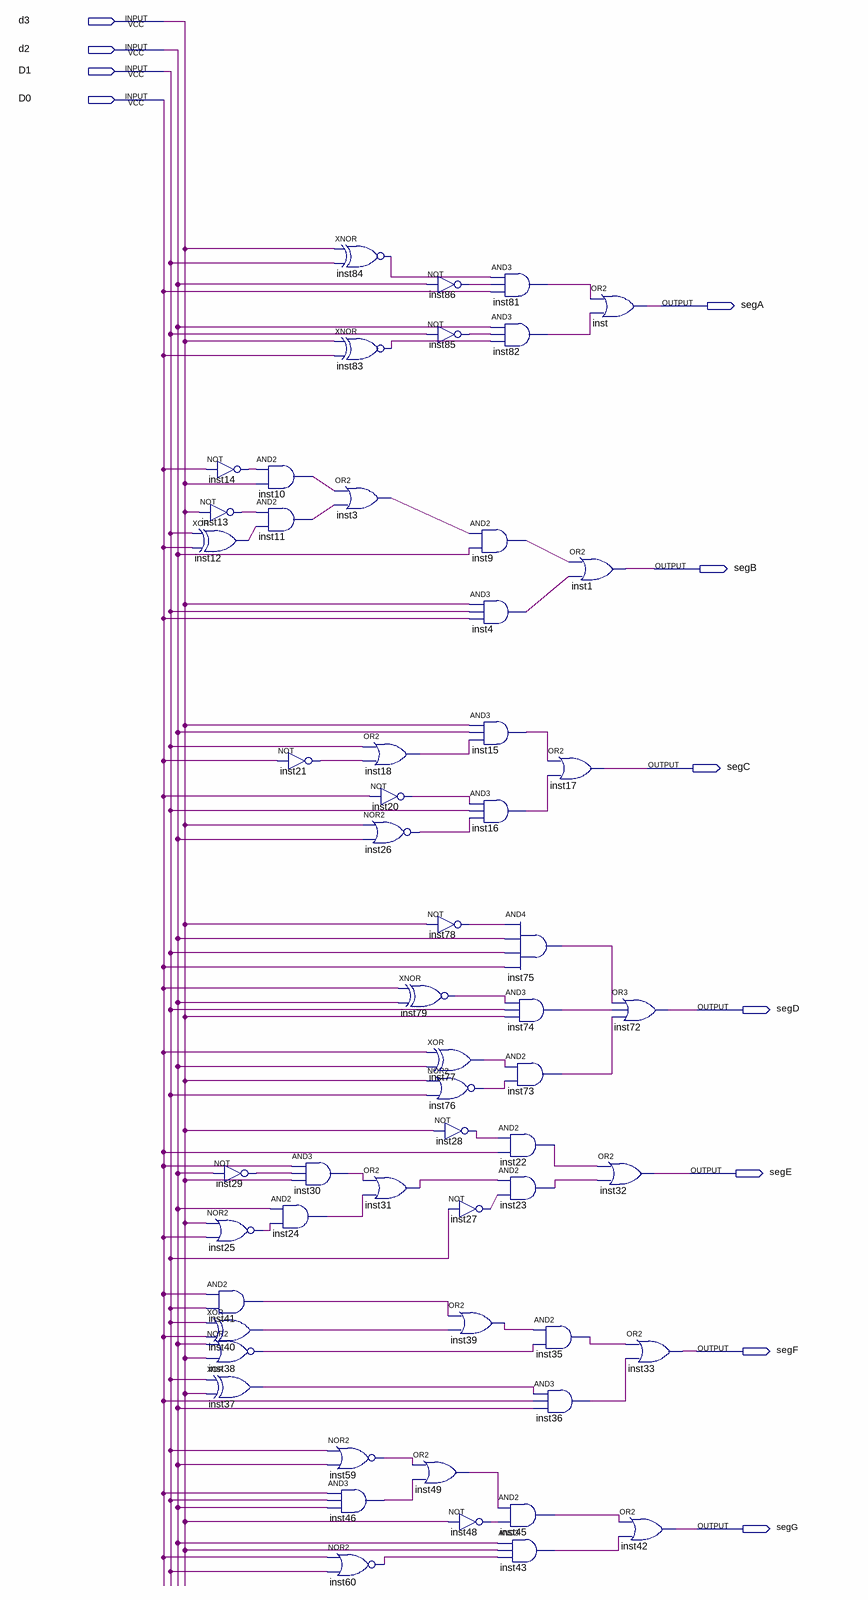
[diagram p0: schematic sheet]
// Quartus schematic display7Segmentos.bdf as structural Verilog: 57 symbols, 11 pins
module display7Segmentos (
  input  d3,
  input  d2,
  input  D1,
  input  D0,
  output segA,
  output segB,
  output segC,
  output segD,
  output segE,
  output segF,
  output segG
);

  wire inst3_out, inst4_out, inst9_out, inst10_out, inst11_out, inst12_out, inst13_out, inst14_out,
       inst15_out, inst16_out, inst18_out, inst20_out, inst21_out, inst22_out, inst23_out, inst24_out,
       inst25_out, inst26_out, inst27_out, inst28_out, inst29_out, inst30_out, inst31_out, inst35_out,
       inst36_out, inst37_out, inst38_out, inst39_out, inst40_out, inst41_out, inst43_out, inst45_out,
       inst46_out, inst48_out, inst49_out, inst59_out, inst60_out, inst73_out, inst74_out, inst75_out,
       inst76_out, inst77_out, inst78_out, inst79_out, inst81_out, inst82_out, inst83_out, inst84_out,
       inst85_out, inst86_out;

  not inst14 (inst14_out, D0);
  not inst13 (inst13_out, d3);
  xor inst12 (inst12_out, D1, D0);
  not inst29 (inst29_out, d2);
  nor inst25 (inst25_out, d3, D0);
  and inst41 (inst41_out, D0, D1);
  xor inst40 (inst40_out, D1, D0);
  nor inst38 (inst38_out, d2, d3);
  xor inst37 (inst37_out, D1, d3);
  and inst10 (inst10_out, inst14_out, d3);
  and inst11 (inst11_out, inst13_out, inst12_out);
  not inst21 (inst21_out, D0);
  and inst24 (inst24_out, d2, inst25_out);
  xnor inst84 (inst84_out, d3, D1);
  xnor inst83 (inst83_out, d3, D0);
  or inst3 (inst3_out, inst10_out, inst11_out);
  and inst30 (inst30_out, D0, inst29_out, d3);
  nor inst59 (inst59_out, D1, d2);
  and inst46 (inst46_out, D0, D1, d2);
  nor inst60 (inst60_out, D0, D1);
  or inst18 (inst18_out, D1, inst21_out);
  not inst20 (inst20_out, D0);
  nor inst26 (inst26_out, d3, d2);
  xnor inst79 (inst79_out, D0, d2);
  or inst31 (inst31_out, inst30_out, inst24_out);
  not inst86 (inst86_out, d2);
  not inst85 (inst85_out, D1);
  not inst78 (inst78_out, d3);
  xor inst77 (inst77_out, D0, d2);
  nor inst76 (inst76_out, d3, D1);
  not inst28 (inst28_out, d3);
  not inst27 (inst27_out, D1);
  or inst39 (inst39_out, inst41_out, inst40_out);
  or inst49 (inst49_out, inst59_out, inst46_out);
  not inst48 (inst48_out, d3);
  and inst81 (inst81_out, inst84_out, inst86_out, D0);
  and inst82 (inst82_out, d2, inst85_out, inst83_out);
  and inst9 (inst9_out, inst3_out, d2);
  and inst4 (inst4_out, d3, D1, D0);
  and inst15 (inst15_out, d3, d2, inst18_out);
  and inst16 (inst16_out, inst20_out, D1, inst26_out);
  and inst75 (inst75_out, inst78_out, d2, D1, D0);
  and inst74 (inst74_out, inst79_out, D1, d3);
  and inst73 (inst73_out, inst77_out, inst76_out);
  and inst22 (inst22_out, inst28_out, D0);
  and inst23 (inst23_out, inst31_out, inst27_out);
  and inst45 (inst45_out, inst49_out, inst48_out);
  and inst43 (inst43_out, d2, d3, inst60_out);
  or inst1 (segB, inst9_out, inst4_out);
  or inst17 (segC, inst15_out, inst16_out);
  and inst35 (inst35_out, inst39_out, inst38_out);
  and inst36 (inst36_out, inst37_out, D0, d2);
  or inst (segA, inst81_out, inst82_out);
  or inst72 (segD, inst75_out, inst74_out, inst73_out);
  or inst32 (segE, inst22_out, inst23_out);
  or inst33 (segF, inst35_out, inst36_out);
  or inst42 (segG, inst45_out, inst43_out);
endmodule
